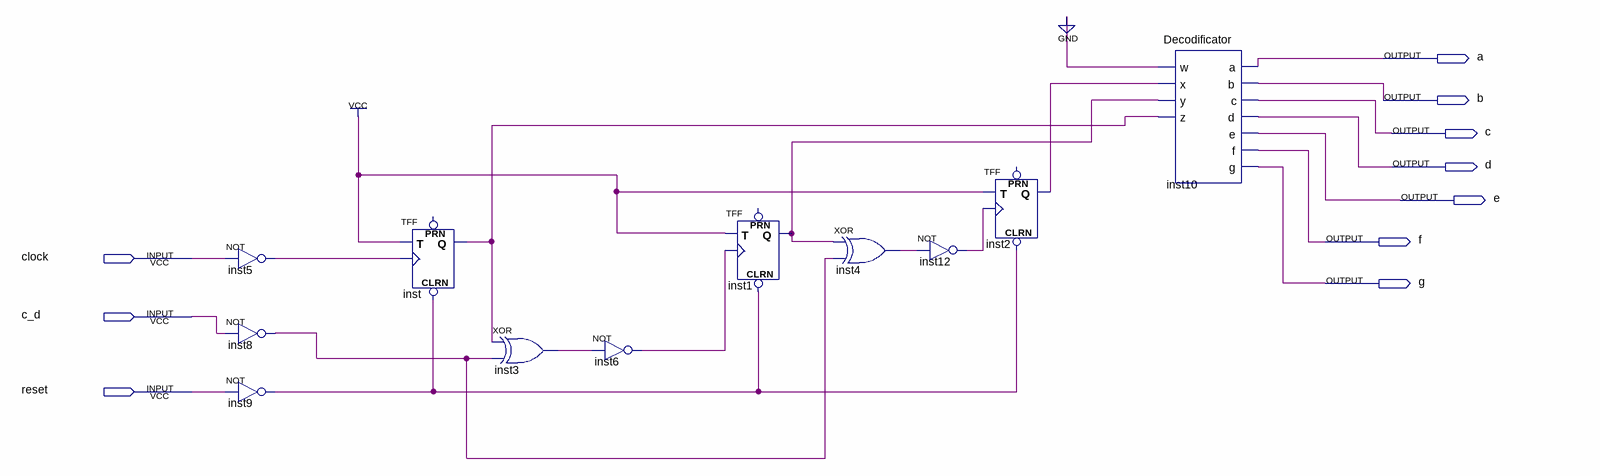
[diagram p0: schematic sheet]
// Quartus schematic contadorascresdec.bdf as structural Verilog: 11 symbols, 10 pins
module contadorascresdec (
  input  clock,
  input  c_d,
  input  reset,
  output a,
  output b,
  output c,
  output d,
  output e,
  output f,
  output g
);

  wire inst1_q, inst2_q, inst3_out, inst4_out, inst5_out, inst6_out, inst8_out, inst9_out, inst12_out, inst_q;

  not inst5 (inst5_out, clock);
  not inst8 (inst8_out, c_d);
  not inst9 (inst9_out, reset);
  TFF inst (.CLRN(inst9_out), .T(1'b1), .CLK(inst5_out), .Q(inst_q));  // open: PRN
  xor inst3 (inst3_out, inst_q, inst8_out);
  not inst6 (inst6_out, inst3_out);
  TFF inst1 (.CLRN(inst9_out), .T(1'b1), .CLK(inst6_out), .Q(inst1_q));  // open: PRN
  xor inst4 (inst4_out, inst1_q, inst8_out);
  not inst12 (inst12_out, inst4_out);
  TFF inst2 (.CLRN(inst9_out), .T(1'b1), .CLK(inst12_out), .Q(inst2_q));  // open: PRN
  Decodificator inst10 (
    .w(1'b0), .x(inst2_q), .y(inst1_q), .z(inst_q), .a(a), .b(b), .c(c), .d(d), .e(e), .f(f), .g(g));
endmodule
